# EAGLE board proto2 (EAGLE 6.6.0), part 1 of 2
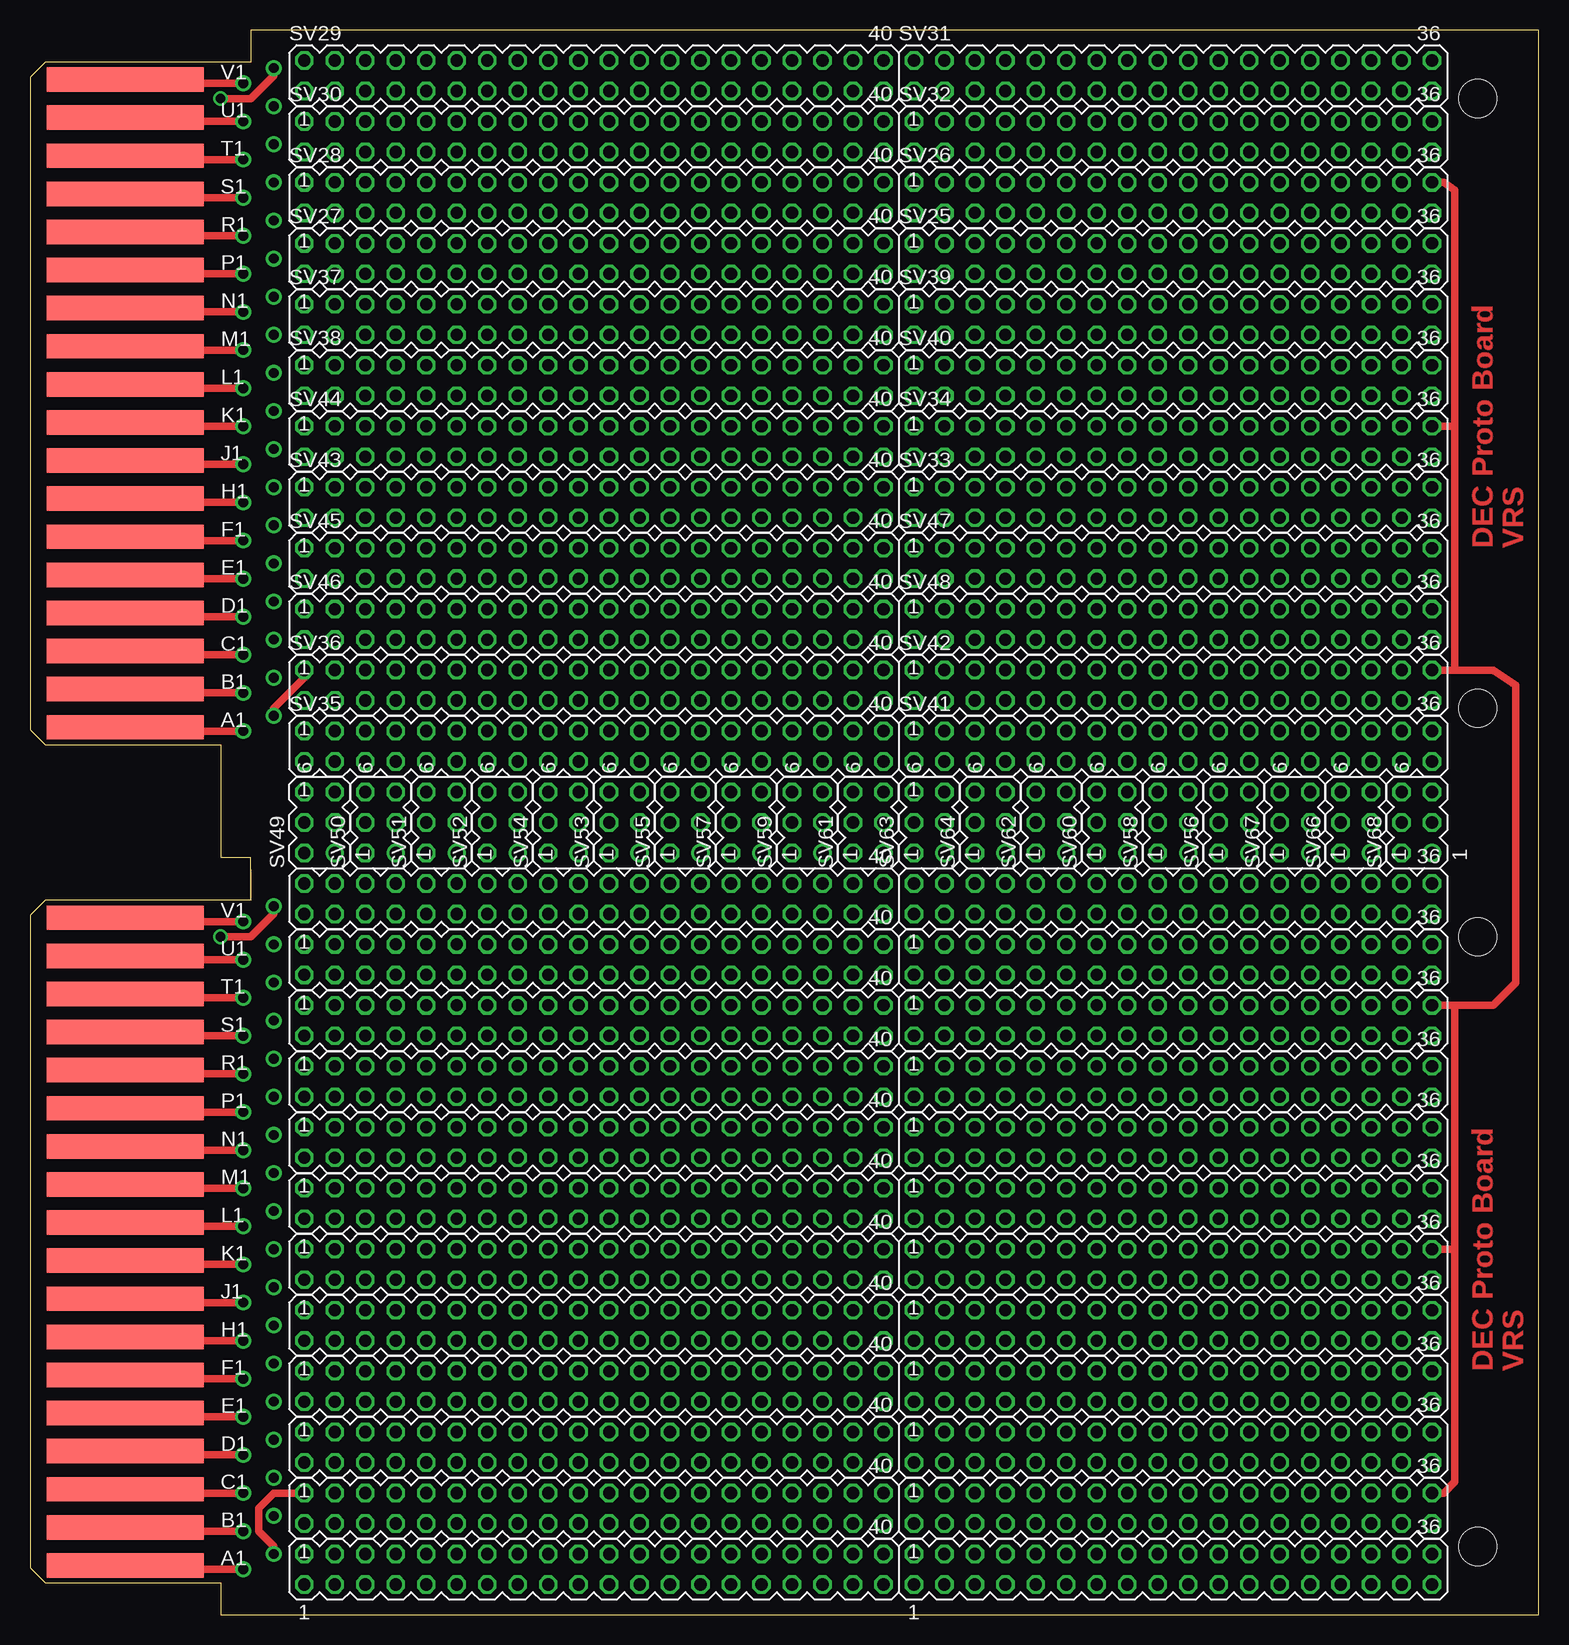
[diagram p1: board, top side]
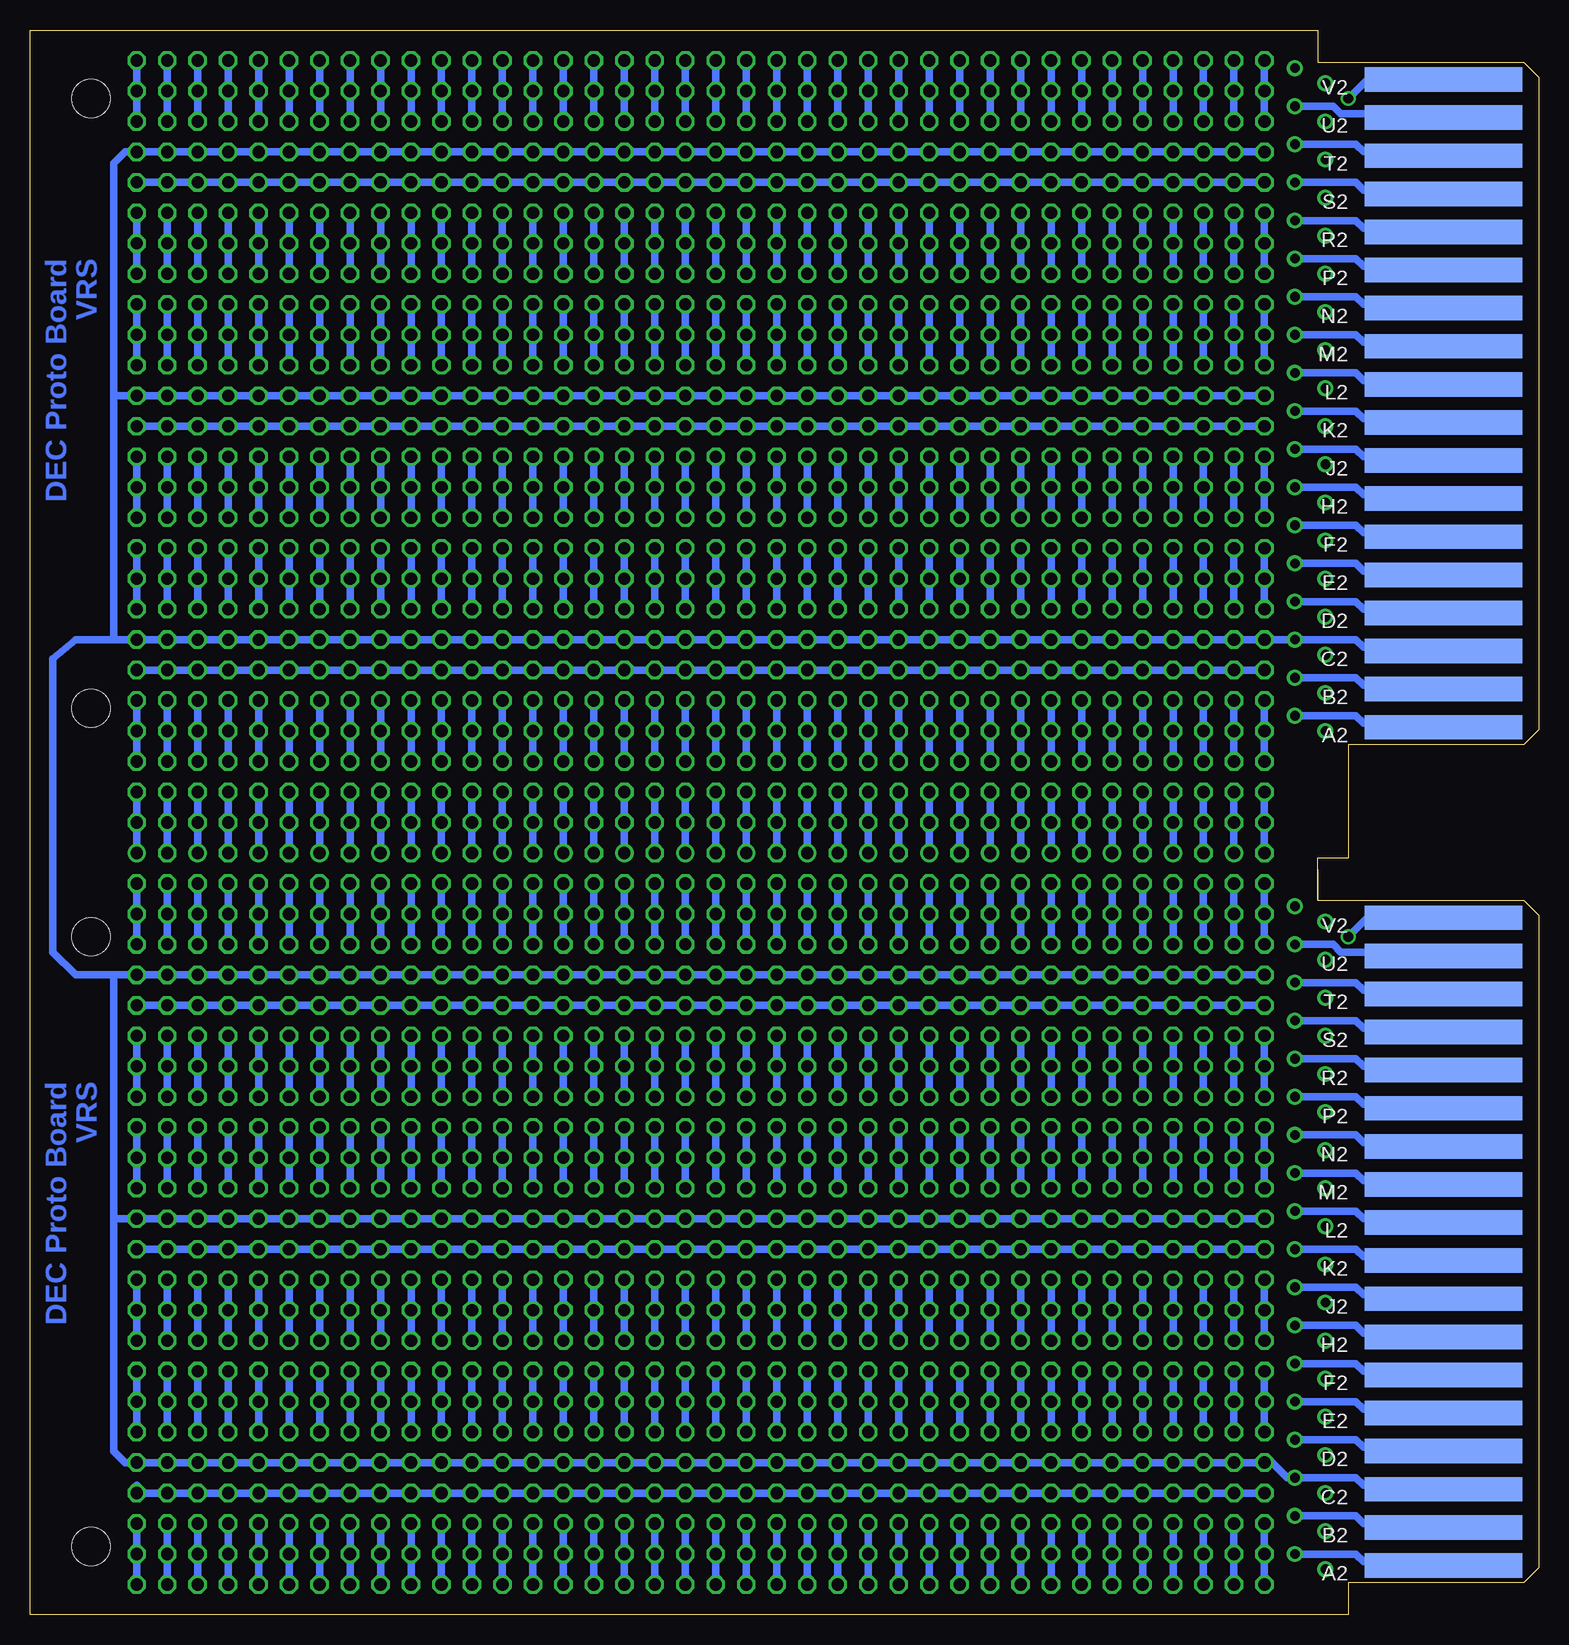
[diagram p2: board, bottom side, seen from below]

Size 125.73 x 132.08 mm. Coordinates in mm from the lower left corner, seen from the top.
Copper layers (1+16): Top 0.035mm / dielectric 1.5mm / Bottom 0.035mm
Design rules "16mils": minimum track width 16mil, minimum drill 32mil, track to track 15mil, track to pad 10mil, pad to pad 10mil, via to via 10mil, smd to smd 10mil, copper to edge 13mil, drill to drill 10mil, minimum pad ring 10mil, minimum via ring 8mil, stop-mask expansion 0mil, vias tented up to drill 0mil, thermal gap 10mil
Net classes: 0 default: width 0.635 mm

## Footprints (pad centres in the part's own frame; a part is rotated, then mirrored left to right if it is on the bottom)
EDGE-CON2 = smd 13.106 x 2.032: A1 7.938,4.128; B1 7.938,7.303; C1 7.938,10.477; D1 7.938,13.652; E1 7.938,16.828; F1 7.938,20.003; H1 7.938,23.177; J1 7.938,26.352; K1 7.938,29.527; L1 7.938,32.703; M1 7.938,35.877; N1 7.938,39.053; P1 7.938,42.227; R1 7.938,45.403; S1 7.938,48.578; T1 7.938,51.752; U1 7.938,54.928; V1 7.938,58.102 | smd 13.106 x 2.032 bottom: A2 7.938,4.128; B2 7.938,7.303; C2 7.938,10.477; D2 7.938,13.652; E2 7.938,16.828; F2 7.938,20.003; H2 7.938,23.177; J2 7.938,26.352; K2 7.938,29.527; L2 7.938,32.703; M2 7.938,35.877; N2 7.938,39.053; P2 7.938,42.227; R2 7.938,45.403; S2 7.938,48.578; T2 7.938,51.752; U2 7.938,54.928; V2 7.938,58.102
MA20-2 = drill 1.016 octagon: 1 -24.13,-1.27; 2 -24.13,1.27; 3 -21.59,-1.27; 4 -21.59,1.27; 5 -19.05,-1.27; 6 -19.05,1.27; 7 -16.51,-1.27; 8 -16.51,1.27; 9 -13.97,-1.27; 10 -13.97,1.27; 11 -11.43,-1.27; 12 -11.43,1.27; 13 -8.89,-1.27; 14 -8.89,1.27; 15 -6.35,-1.27; 16 -6.35,1.27; 17 -3.81,-1.27; 18 -3.81,1.27; 19 -1.27,-1.27; 20 -1.27,1.27; 21 1.27,-1.27; 22 1.27,1.27; 23 3.81,-1.27; 24 3.81,1.27; 25 6.35,-1.27; 26 6.35,1.27; 27 8.89,-1.27; 28 8.89,1.27; 29 11.43,-1.27; 30 11.43,1.27; 31 13.97,-1.27; 32 13.97,1.27; 33 16.51,-1.27; 34 16.51,1.27; 35 19.05,-1.27; 36 19.05,1.27; 37 21.59,-1.27; 38 21.59,1.27; 39 24.13,-1.27; 40 24.13,1.27
MA18-2 = drill 1.016 octagon: 1 -21.59,-1.27; 2 -21.59,1.27; 3 -19.05,-1.27; 4 -19.05,1.27; 5 -16.51,-1.27; 6 -16.51,1.27; 7 -13.97,-1.27; 8 -13.97,1.27; 9 -11.43,-1.27; 10 -11.43,1.27; 11 -8.89,-1.27; 12 -8.89,1.27; 13 -6.35,-1.27; 14 -6.35,1.27; 15 -3.81,-1.27; 16 -3.81,1.27; 17 -1.27,-1.27; 18 -1.27,1.27; 19 1.27,-1.27; 20 1.27,1.27; 21 3.81,-1.27; 22 3.81,1.27; 23 6.35,-1.27; 24 6.35,1.27; 25 8.89,-1.27; 26 8.89,1.27; 27 11.43,-1.27; 28 11.43,1.27; 29 13.97,-1.27; 30 13.97,1.27; 31 16.51,-1.27; 32 16.51,1.27; 33 19.05,-1.27; 34 19.05,1.27; 35 21.59,-1.27; 36 21.59,1.27
MA03-2 = drill 1.016: 1 -2.54,-1.27 | drill 1.016 octagon: 2 -2.54,1.27; 3 0,-1.27; 4 0,1.27; 5 2.54,-1.27; 6 2.54,1.27
THRU-HOLEA = drill 0.813 pad 1.27: A1 17.78,3.81; A2 20.32,5.08; B1 17.78,6.985; B2 20.32,8.255; C1 17.78,10.16; C2 20.32,11.43; D1 17.78,13.335; D2 20.32,14.605; E1 17.78,16.51; E2 20.32,17.78; F1 17.78,19.685; F2 20.32,20.955; H1 17.78,22.86; H2 20.32,24.13; J1 17.78,26.035; J2 20.32,27.305; K1 17.78,29.21; K2 20.32,30.48; L1 17.78,32.385; L2 20.32,33.655; M1 17.78,35.56; M2 20.32,36.83; N1 17.78,38.735; N2 20.32,40.005; P1 17.78,41.91; P2 20.32,43.18; R1 17.78,45.085; R2 20.32,46.355; S1 17.78,48.26; S2 20.32,49.53; T1 17.78,51.435; T2 20.32,52.705; U1 17.78,54.61; U2 20.32,55.88; V1 17.78,57.785; V2 20.32,59.055
DOUBLE = hole 3.175: 120.65,56.515; 120.65,5.715; 120.65,75.565; 120.65,126.365

## Placement (x,y rotation side)
A  [EDGE-CON2]  0,0 0 top
B  [EDGE-CON2]  0,69.85 0 top
SV1  [MA20-2]  46.99,3.81 0 top
SV2  [MA20-2]  46.99,8.89 0 top
SV3  [MA20-2]  46.99,19.05 0 top
SV4  [MA20-2]  46.99,13.97 0 top
SV5  [MA18-2]  95.25,19.05 0 top
SV6  [MA18-2]  95.25,13.97 0 top
SV7  [MA18-2]  95.25,3.81 0 top
SV8  [MA18-2]  95.25,8.89 0 top
SV9  [MA18-2]  95.25,24.13 0 top
SV10  [MA18-2]  95.25,29.21 0 top
SV11  [MA20-2]  46.99,24.13 0 top
SV12  [MA20-2]  46.99,29.21 0 top
SV13  [MA20-2]  46.99,39.37 0 top
SV14  [MA20-2]  46.99,34.29 0 top
SV15  [MA18-2]  95.25,39.37 0 top
SV16  [MA18-2]  95.25,34.29 0 top
SV17  [MA18-2]  95.25,44.45 0 top
SV18  [MA18-2]  95.25,49.53 0 top
SV19  [MA20-2]  46.99,44.45 0 top
SV20  [MA20-2]  46.99,49.53 0 top
SV21  [MA20-2]  46.99,59.69 0 top
SV22  [MA20-2]  46.99,54.61 0 top
SV23  [MA18-2]  95.25,59.69 0 top
SV24  [MA18-2]  95.25,54.61 0 top
SV25  [MA18-2]  95.25,113.03 0 top
SV26  [MA18-2]  95.25,118.11 0 top
SV27  [MA20-2]  46.99,113.03 0 top
SV28  [MA20-2]  46.99,118.11 0 top
SV29  [MA20-2]  46.99,128.27 0 top
SV30  [MA20-2]  46.99,123.19 0 top
SV31  [MA18-2]  95.25,128.27 0 top
SV32  [MA18-2]  95.25,123.19 0 top
SV33  [MA18-2]  95.25,92.71 0 top
SV34  [MA18-2]  95.25,97.79 0 top
SV35  [MA20-2]  46.99,72.39 0 top
SV36  [MA20-2]  46.99,77.47 0 top
SV37  [MA20-2]  46.99,107.95 0 top
SV38  [MA20-2]  46.99,102.87 0 top
SV39  [MA18-2]  95.25,107.95 0 top
SV40  [MA18-2]  95.25,102.87 0 top
SV41  [MA18-2]  95.25,72.39 0 top
SV42  [MA18-2]  95.25,77.47 0 top
SV43  [MA20-2]  46.99,92.71 0 top
SV44  [MA20-2]  46.99,97.79 0 top
SV45  [MA20-2]  46.99,87.63 0 top
SV46  [MA20-2]  46.99,82.55 0 top
SV47  [MA18-2]  95.25,87.63 0 top
SV48  [MA18-2]  95.25,82.55 0 top
SV49  [MA03-2]  24.13,66.04 90 top
SV50  [MA03-2]  29.21,66.04 90 top
SV51  [MA03-2]  34.29,66.04 90 top
SV52  [MA03-2]  39.37,66.04 90 top
SV53  [MA03-2]  49.53,66.04 90 top
SV54  [MA03-2]  44.45,66.04 90 top
SV55  [MA03-2]  54.61,66.04 90 top
SV56  [MA03-2]  100.33,66.04 90 top
SV57  [MA03-2]  59.69,66.04 90 top
SV58  [MA03-2]  95.25,66.04 90 top
SV59  [MA03-2]  64.77,66.04 90 top
SV60  [MA03-2]  90.17,66.04 90 top
SV61  [MA03-2]  69.85,66.04 90 top
SV62  [MA03-2]  85.09,66.04 90 top
SV63  [MA03-2]  74.93,66.04 90 top
SV64  [MA03-2]  80.01,66.04 90 top
SV66  [MA03-2]  110.49,66.04 90 top
SV67  [MA03-2]  105.41,66.04 90 top
SV68  [MA03-2]  115.57,66.04 90 top
U$3  THRU-HOLE2A  [THRU-HOLEA]  0,0 0 top
U$4  OUTLINE-DOUBLE  [DOUBLE]  0,0 0 top
U$5  THRU-HOLE2A  [THRU-HOLEA]  0,69.85 0 top

## Tracks (layer width: path | path; a pad name or v marks a point on that pad's centre or on a via)
GND
  Bottom 0.635: SV14.1 SV14.3 SV14.5 SV14.7 SV14.9 SV14.11 SV14.13 SV14.15 SV14.17 SV14.19 SV14.21 SV14.23 SV14.25 SV14.27 SV14.29 SV14.31 SV14.33 SV14.35 SV14.37 SV14.39 SV16.1 SV16.3 SV16.5 SV16.7 SV16.9 SV16.11 SV16.13 SV16.15 SV16.17 SV16.19 SV16.21 SV16.23 SV16.25 SV16.27 SV16.29 SV16.31 SV16.33 SV16.35 118.75,33.02 | A.C2 14.61,10.79 15.24,11.43 U$3.C2 20.96,11.43 22.23,12.7 SV4.1 SV4.3 SV4.5 SV4.7 SV4.9 SV4.11 SV4.13 SV4.15 SV4.17 SV4.19 SV4.21 SV4.23 SV4.25 SV4.27 SV4.29 SV4.31 SV4.33 SV4.35 SV4.37 SV4.39 SV6.1 SV6.3 SV6.5 SV6.7 SV6.9 SV6.11 SV6.13 SV6.15 SV6.17 SV6.19 SV6.21 SV6.23 SV6.25 SV6.27 SV6.29 SV6.31 SV6.33 SV6.35 117.79,12.7 118.75,13.65 118.75,33.02 | SV30.1 SV30.3 SV30.5 SV30.7 SV30.9 SV30.11 SV30.13 SV30.15 SV30.17 SV30.19 SV30.21 SV30.23 SV30.25 SV30.27 SV30.29 SV30.31 SV30.33 SV30.35 SV30.37 SV30.39 SV32.1 SV32.3 SV32.5 SV32.7 SV32.9 SV32.11 SV32.13 SV32.15 SV32.17 SV32.19 SV32.21 SV32.23 SV32.25 SV32.27 SV32.29 SV32.31 SV32.33 SV32.35 117.79,121.92 118.75,120.97 118.75,101.6 | SV38.1 SV38.3 SV38.5 SV38.7 SV38.9 SV38.11 SV38.13 SV38.15 SV38.17 SV38.19 SV38.21 SV38.23 SV38.25 SV38.27 SV38.29 SV38.31 SV38.33 SV38.35 SV38.37 SV38.39 SV40.1 SV40.3 SV40.5 SV40.7 SV40.9 SV40.11 SV40.13 SV40.15 SV40.17 SV40.19 SV40.21 SV40.23 SV40.25 SV40.27 SV40.29 SV40.31 SV40.33 SV40.35 118.75,101.6 | SV22.1 SV22.3 SV22.5 SV22.7 SV22.9 SV22.11 SV22.13 SV22.15 SV22.17 SV22.19 SV22.21 SV22.23 SV22.25 SV22.27 SV22.29 SV22.31 SV22.33 SV22.35 SV22.37 SV22.39 SV24.1 SV24.3 SV24.5 SV24.7 SV24.9 SV24.11 SV24.13 SV24.15 SV24.17 SV24.19 SV24.21 SV24.23 SV24.25 SV24.27 SV24.29 SV24.31 SV24.33 SV24.35 118.75,53.34
  Bottom 0.635: B.C2 14.61,80.64 15.24,81.28 U$5.C2 SV46.1 SV46.3 SV46.5 SV46.7 SV46.9 SV46.11 SV46.13 SV46.15 SV46.17 SV46.19 SV46.21 SV46.23 SV46.25 SV46.27 SV46.29 SV46.31 SV46.33 SV46.35 SV46.37 SV46.39 SV48.1 SV48.3 SV48.5 SV48.7 SV48.9 SV48.11 SV48.13 SV48.15 SV48.17 SV48.19 SV48.21 SV48.23 SV48.25 SV48.27 SV48.29 SV48.31 SV48.33 SV48.35 118.75,81.28 | 118.75,81.28 121.92,81.28 123.83,79.69 123.83,55.24 121.92,53.34 118.75,53.34 | 118.75,81.28 118.75,101.6 | 118.75,33.02 118.75,53.34
N$1
  Bottom 0.635: U$3.K2 15.24,30.48 14.61,29.84 A.K2
N$2
  Bottom 0.635: U$3.J2 15.24,27.3 14.61,26.67 A.J2
N$3
  Bottom 0.635: U$3.H2 15.24,24.13 14.61,23.5 A.H2
N$4
  Bottom 0.635: U$3.L2 15.24,33.66 14.61,33.02 A.L2
N$5
  Bottom 0.635: U$3.M2 15.24,36.83 14.61,36.2 A.M2
N$6
  Bottom 0.635: U$3.N2 15.24,40.01 14.61,39.37 A.N2
N$7
  Bottom 0.635: U$3.P2 15.24,43.18 14.61,42.55 A.P2
N$8
  Bottom 0.635: U$3.F2 15.24,20.95 14.61,20.32 A.F2
N$9
  Bottom 0.635: U$3.E2 15.24,17.78 14.61,17.14 A.E2
N$10
  Bottom 0.635: U$3.D2 15.24,14.61 14.61,13.97 A.D2
N$11
  Bottom 0.635: SV1.1 22.86,3.17 22.86,4.45 SV1.2 22.86,5.71 22.86,6.99 SV2.1
N$12
  Bottom 0.635: U$3.R2 15.24,46.35 14.61,45.72 A.R2
N$13
  Bottom 0.635: U$3.S2 15.24,49.53 14.61,48.9 A.S2
N$14
  Bottom 0.635: U$3.B2 15.24,8.26 14.61,7.62 A.B2
N$15
  Bottom 0.635: SV1.3 25.4,3.17 25.4,4.45 SV1.4 25.4,5.71 25.4,6.99 SV2.3
N$16
  Bottom 0.635: U$3.T2 15.24,52.7 14.61,52.07 A.T2
N$17
  Bottom 0.635: U$3.U2 19.69,55.88 17.15,55.88 16.51,55.24 13.97,55.24 A.U2
N$18  (via drill 0.81)
  Top 0.635: v15.88,56.52 18.42,56.52 20.32,58.42 U$3.V2
  Bottom 0.635: v15.88,56.52 13.97,58.42 A.V2
N$19
  Top 0.635: U$3.A1 17.15,3.81 13.97,3.81 A.A1
N$20
  Top 0.635: U$3.V1 17.15,57.78 13.97,57.78 A.V1
N$21
  Top 0.635: U$3.U1 17.15,54.61 13.97,54.61 A.U1
N$22
  Top 0.635: U$3.T1 17.15,51.44 13.97,51.44 A.T1
N$23
  Top 0.635: U$3.S1 17.15,48.26 13.97,48.26 A.S1
N$24
  Top 0.635: U$3.R1 17.15,45.09 13.97,45.09 A.R1
N$25
  Top 0.635: U$3.P1 17.15,41.91 13.97,41.91 A.P1
N$26
  Top 0.635: U$3.N1 17.15,38.73 13.97,38.73 A.N1
N$27
  Top 0.635: U$3.M1 17.15,35.56 13.97,35.56 A.M1
N$28
  Top 0.635: U$3.L1 17.15,32.38 13.97,32.38 A.L1
N$29
  Top 0.635: U$3.K1 17.15,29.21 13.97,29.21 A.K1
N$30
  Top 0.635: U$3.J1 17.15,26.04 13.97,26.04 A.J1
N$31
  Top 0.635: U$3.H1 17.15,22.86 13.97,22.86 A.H1
N$32
  Top 0.635: U$3.F1 17.15,19.68 13.97,19.68 A.F1
N$33
  Top 0.635: U$3.E1 17.15,16.51 13.97,16.51 A.E1
N$34
  Top 0.635: U$3.D1 17.15,13.34 13.97,13.34 A.D1
N$35
  Top 0.635: U$3.C1 17.15,10.16 13.97,10.16 A.C1
N$36
  Top 0.635: U$3.B1 17.15,6.99 13.97,6.99 A.B1
N$37
  Bottom 0.635: SV1.5 27.94,3.17 27.94,4.45 SV1.6 27.94,5.71 27.94,6.99 SV2.5
N$38
  Bottom 0.635: SV7.1 73.66,3.17 73.66,4.45 SV7.2 73.66,5.71 73.66,6.99 SV8.1
N$39
  Bottom 0.635: SV7.3 76.2,3.17 76.2,4.45 SV7.4 76.2,5.71 76.2,6.99 SV8.3
N$40
  Bottom 0.635: SV7.5 78.74,3.17 78.74,4.45 SV7.6 78.74,5.71 78.74,6.99 SV8.5
N$41
  Bottom 0.635: SV7.7 81.28,3.17 81.28,4.45 SV7.8 81.28,5.71 81.28,6.99 SV8.7
N$42
  Bottom 0.635: SV7.9 83.82,3.17 83.82,4.45 SV7.10 83.82,5.71 83.82,6.99 SV8.9
N$43
  Bottom 0.635: SV7.11 86.36,3.17 86.36,4.45 SV7.12 86.36,5.71 86.36,6.99 SV8.11
N$44
  Bottom 0.635: SV7.13 88.9,3.17 88.9,4.45 SV7.14 88.9,5.71 88.9,6.99 SV8.13
N$45
  Bottom 0.635: SV1.7 30.48,3.17 30.48,4.45 SV1.8 30.48,5.71 30.48,6.99 SV2.7
N$46
  Bottom 0.635: SV1.9 33.02,3.17 33.02,4.45 SV1.10 33.02,5.71 33.02,6.99 SV2.9
N$47
  Bottom 0.635: SV1.11 35.56,3.17 35.56,4.45 SV1.12 35.56,5.71 35.56,6.99 SV2.11
N$48
  Bottom 0.635: SV1.13 38.1,3.17 38.1,4.45 SV1.14 38.1,5.71 38.1,6.99 SV2.13
N$49
  Bottom 0.635: SV1.15 40.64,3.17 40.64,4.45 SV1.16 40.64,5.71 40.64,6.99 SV2.15
N$50
  Bottom 0.635: SV1.17 43.18,3.17 43.18,4.45 SV1.18 43.18,5.71 43.18,6.99 SV2.17
N$51
  Bottom 0.635: SV1.19 45.72,3.17 45.72,4.45 SV1.20 45.72,5.71 45.72,6.99 SV2.19
N$52
  Bottom 0.635: SV1.21 48.26,3.17 48.26,4.45 SV1.22 48.26,5.71 48.26,6.99 SV2.21
N$53
  Bottom 0.635: SV1.23 50.8,3.17 50.8,4.45 SV1.24 50.8,5.71 50.8,6.99 SV2.23
N$54
  Bottom 0.635: SV1.25 53.34,3.17 53.34,4.45 SV1.26 53.34,5.71 53.34,6.99 SV2.25
N$55
  Bottom 0.635: SV1.27 55.88,3.17 55.88,4.45 SV1.28 55.88,5.71 55.88,6.99 SV2.27
N$56
  Bottom 0.635: SV1.29 58.42,3.17 58.42,4.45 SV1.30 58.42,5.71 58.42,6.99 SV2.29
N$57
  Bottom 0.635: SV1.31 60.96,3.17 60.96,4.45 SV1.32 60.96,5.71 60.96,6.99 SV2.31
N$58
  Bottom 0.635: SV1.33 63.5,3.17 63.5,4.45 SV1.34 63.5,5.71 63.5,6.99 SV2.33
N$59
  Bottom 0.635: SV1.35 66.04,3.17 66.04,4.45 SV1.36 66.04,5.71 66.04,6.99 SV2.35
N$60
  Bottom 0.635: SV1.37 68.58,3.17 68.58,4.45 SV1.38 68.58,5.71 68.58,6.99 SV2.37
N$61
  Bottom 0.635: SV1.39 71.12,3.17 71.12,4.45 SV1.40 71.12,5.71 71.12,6.99 SV2.39
N$62
  Bottom 0.635: SV7.15 91.44,3.17 91.44,4.45 SV7.16 91.44,5.71 91.44,6.99 SV8.15
N$63
  Bottom 0.635: SV7.17 93.98,3.17 93.98,4.45 SV7.18 93.98,5.71 93.98,6.99 SV8.17
N$64
  Bottom 0.635: SV7.19 96.52,3.17 96.52,4.45 SV7.20 96.52,5.71 96.52,6.99 SV8.19
N$65
  Bottom 0.635: SV7.21 99.06,3.17 99.06,4.45 SV7.22 99.06,5.71 99.06,6.99 SV8.21
N$66
  Bottom 0.635: SV7.23 101.6,3.17 101.6,4.45 SV7.24 101.6,5.71 101.6,6.99 SV8.23
N$67
  Bottom 0.635: SV7.25 104.14,3.17 104.14,4.45 SV7.26 104.14,5.71 104.14,6.99 SV8.25
N$68
  Bottom 0.635: SV7.27 106.68,3.17 106.68,4.45 SV7.28 106.68,5.71 106.68,6.99 SV8.27
N$69
  Bottom 0.635: SV7.29 109.22,3.17 109.22,4.45 SV7.30 109.22,5.71 109.22,6.99 SV8.29
N$70
  Bottom 0.635: SV7.31 111.76,3.17 111.76,4.45 SV7.32 111.76,5.71 111.76,6.99 SV8.31
N$71
  Bottom 0.635: SV7.33 114.3,3.17 114.3,4.45 SV7.34 114.3,5.71 114.3,6.99 SV8.33
N$72
  Bottom 0.635: SV7.35 116.84,3.17 116.84,4.45 SV7.36 116.84,5.71 116.84,6.99 SV8.35
N$73
  Bottom 0.635: SV4.40 71.12,15.88 71.12,17.14 SV3.39 71.12,18.41 71.12,19.68 SV3.40
N$74
  Bottom 0.635: SV4.38 68.58,15.88 68.58,17.14 SV3.37 68.58,18.41 68.58,19.68 SV3.38
N$75
  Bottom 0.635: SV4.36 66.04,15.88 66.04,17.14 SV3.35 66.04,18.41 66.04,19.68 SV3.36
N$76
  Bottom 0.635: SV4.34 63.5,15.88 63.5,17.14 SV3.33 63.5,18.41 63.5,19.68 SV3.34
N$77
  Bottom 0.635: SV4.32 60.96,15.88 60.96,17.14 SV3.31 60.96,18.41 60.96,19.68 SV3.32
N$78
  Bottom 0.635: SV4.30 58.42,15.88 58.42,17.14 SV3.29 58.42,18.41 58.42,19.68 SV3.30
N$79
  Bottom 0.635: SV4.28 55.88,15.88 55.88,17.14 SV3.27 55.88,18.41 55.88,19.68 SV3.28
N$80
  Bottom 0.635: SV4.26 53.34,15.88 53.34,17.14 SV3.25 53.34,18.41 53.34,19.68 SV3.26
N$81
  Bottom 0.635: SV4.24 50.8,15.88 50.8,17.14 SV3.23 50.8,18.41 50.8,19.68 SV3.24
N$82
  Bottom 0.635: SV4.22 48.26,15.88 48.26,17.14 SV3.21 48.26,18.41 48.26,19.68 SV3.22
N$83
  Bottom 0.635: SV4.20 45.72,15.88 45.72,17.14 SV3.19 45.72,18.41 45.72,19.68 SV3.20
N$84
  Bottom 0.635: SV4.18 43.18,15.88 43.18,17.14 SV3.17 43.18,18.41 43.18,19.68 SV3.18
N$85
  Bottom 0.635: SV4.16 40.64,15.88 40.64,17.14 SV3.15 40.64,18.41 40.64,19.68 SV3.16
N$86
  Bottom 0.635: SV4.14 38.1,15.88 38.1,17.14 SV3.13 38.1,18.41 38.1,19.68 SV3.14
N$87
  Bottom 0.635: SV4.12 35.56,15.88 35.56,17.14 SV3.11 35.56,18.41 35.56,19.68 SV3.12
N$88
  Bottom 0.635: SV4.10 33.02,15.88 33.02,17.14 SV3.9 33.02,18.41 33.02,19.68 SV3.10
N$89
  Bottom 0.635: SV4.8 30.48,15.88 30.48,17.14 SV3.7 30.48,18.41 30.48,19.68 SV3.8
N$90
  Bottom 0.635: SV4.6 27.94,15.88 27.94,17.14 SV3.5 27.94,18.41 27.94,19.68 SV3.6
N$91
  Bottom 0.635: SV4.4 25.4,15.88 25.4,17.14 SV3.3 25.4,18.41 25.4,19.68 SV3.4
N$92
  Bottom 0.635: SV4.2 22.86,15.88 22.86,17.14 SV3.1 22.86,18.41 22.86,19.68 SV3.2
N$93
  Bottom 0.635: SV11.1 22.86,23.5 22.86,24.77 SV11.2 22.86,26.04 22.86,27.3 SV12.1
N$94
  Bottom 0.635: SV6.36 116.84,15.88 116.84,17.14 SV5.35 116.84,18.41 116.84,19.68 SV5.36
N$95
  Bottom 0.635: SV6.34 114.3,15.88 114.3,17.14 SV5.33 114.3,18.41 114.3,19.68 SV5.34
N$96
  Bottom 0.635: SV6.32 111.76,15.88 111.76,17.14 SV5.31 111.76,18.41 111.76,19.68 SV5.32
N$97
  Bottom 0.635: SV6.30 109.22,15.88 109.22,17.14 SV5.29 109.22,18.41 109.22,19.68 SV5.30
N$98
  Bottom 0.635: SV6.28 106.68,15.88 106.68,17.14 SV5.27 106.68,18.41 106.68,19.68 SV5.28
N$99
  Bottom 0.635: SV6.26 104.14,15.88 104.14,17.14 SV5.25 104.14,18.41 104.14,19.68 SV5.26
N$100
  Bottom 0.635: SV6.24 101.6,15.88 101.6,17.14 SV5.23 101.6,18.41 101.6,19.68 SV5.24
N$101
  Bottom 0.635: SV6.22 99.06,15.88 99.06,17.14 SV5.21 99.06,18.41 99.06,19.68 SV5.22
N$102
  Bottom 0.635: SV6.20 96.52,15.88 96.52,17.14 SV5.19 96.52,18.41 96.52,19.68 SV5.20
N$103
  Bottom 0.635: SV6.18 93.98,15.88 93.98,17.14 SV5.17 93.98,18.41 93.98,19.68 SV5.18
N$104
  Bottom 0.635: SV6.16 91.44,15.88 91.44,17.14 SV5.15 91.44,18.41 91.44,19.68 SV5.16
N$105
  Bottom 0.635: SV6.14 88.9,15.88 88.9,17.14 SV5.13 88.9,18.41 88.9,19.68 SV5.14
N$106
  Bottom 0.635: SV6.12 86.36,15.88 86.36,17.14 SV5.11 86.36,18.41 86.36,19.68 SV5.12
N$107
  Bottom 0.635: SV6.10 83.82,15.88 83.82,17.14 SV5.9 83.82,18.41 83.82,19.68 SV5.10
N$108
  Bottom 0.635: SV6.8 81.28,15.88 81.28,17.14 SV5.7 81.28,18.41 81.28,19.68 SV5.8
N$109
  Bottom 0.635: SV6.6 78.74,15.88 78.74,17.14 SV5.5 78.74,18.41 78.74,19.68 SV5.6
N$110
  Bottom 0.635: SV6.4 76.2,15.88 76.2,17.14 SV5.3 76.2,18.41 76.2,19.68 SV5.4
N$111
  Bottom 0.635: SV6.2 73.66,15.88 73.66,17.14 SV5.1 73.66,18.41 73.66,19.68 SV5.2
N$112
  Bottom 0.635: SV11.3 25.4,23.5 25.4,24.77 SV11.4 25.4,26.04 25.4,27.3 SV12.3
N$113
  Bottom 0.635: SV11.5 27.94,23.5 27.94,24.77 SV11.6 27.94,26.04 27.94,27.3 SV12.5
N$114
  Bottom 0.635: SV11.7 30.48,23.5 30.48,24.77 SV11.8 30.48,26.04 30.48,27.3 SV12.7
N$115
  Bottom 0.635: SV11.9 33.02,23.5 33.02,24.77 SV11.10 33.02,26.04 33.02,27.3 SV12.9
N$116
  Bottom 0.635: SV11.11 35.56,23.5 35.56,24.77 SV11.12 35.56,26.04 35.56,27.3 SV12.11
N$117
  Bottom 0.635: SV11.13 38.1,23.5 38.1,24.77 SV11.14 38.1,26.04 38.1,27.3 SV12.13
N$118
  Bottom 0.635: SV11.15 40.64,23.5 40.64,24.77 SV11.16 40.64,26.04 40.64,27.3 SV12.15
N$119
  Bottom 0.635: SV11.17 43.18,23.5 43.18,24.77 SV11.18 43.18,26.04 43.18,27.3 SV12.17
N$120
  Bottom 0.635: SV11.19 45.72,23.5 45.72,24.77 SV11.20 45.72,26.04 45.72,27.3 SV12.19
N$121
  Bottom 0.635: SV11.21 48.26,23.5 48.26,24.77 SV11.22 48.26,26.04 48.26,27.3 SV12.21
N$122
  Bottom 0.635: SV11.23 50.8,23.5 50.8,24.77 SV11.24 50.8,26.04 50.8,27.3 SV12.23
N$123
  Bottom 0.635: SV11.25 53.34,23.5 53.34,24.77 SV11.26 53.34,26.04 53.34,27.3 SV12.25
N$124
  Bottom 0.635: SV11.27 55.88,23.5 55.88,24.77 SV11.28 55.88,26.04 55.88,27.3 SV12.27
N$125
  Bottom 0.635: SV11.29 58.42,23.5 58.42,24.77 SV11.30 58.42,26.04 58.42,27.3 SV12.29
N$126
  Bottom 0.635: SV11.31 60.96,23.5 60.96,24.77 SV11.32 60.96,26.04 60.96,27.3 SV12.31
N$127
  Bottom 0.635: SV11.33 63.5,23.5 63.5,24.77 SV11.34 63.5,26.04 63.5,27.3 SV12.33
N$128
  Bottom 0.635: SV11.35 66.04,23.5 66.04,24.77 SV11.36 66.04,26.04 66.04,27.3 SV12.35
N$129
  Bottom 0.635: SV11.37 68.58,23.5 68.58,24.77 SV11.38 68.58,26.04 68.58,27.3 SV12.37
N$130
  Bottom 0.635: SV11.39 71.12,23.5 71.12,24.77 SV11.40 71.12,26.04 71.12,27.3 SV12.39
N$131
  Bottom 0.635: SV9.1 73.66,23.5 73.66,24.77 SV9.2 73.66,26.04 73.66,27.3 SV10.1
N$132
  Bottom 0.635: SV9.3 76.2,23.5 76.2,24.77 SV9.4 76.2,26.04 76.2,27.3 SV10.3
N$133
  Bottom 0.635: SV9.5 78.74,23.5 78.74,24.77 SV9.6 78.74,26.04 78.74,27.3 SV10.5
N$134
  Bottom 0.635: SV9.7 81.28,23.5 81.28,24.77 SV9.8 81.28,26.04 81.28,27.3 SV10.7
N$135
  Bottom 0.635: SV9.9 83.82,23.5 83.82,24.77 SV9.10 83.82,26.04 83.82,27.3 SV10.9
N$136
  Bottom 0.635: SV9.11 86.36,23.5 86.36,24.77 SV9.12 86.36,26.04 86.36,27.3 SV10.11
N$137
  Bottom 0.635: SV9.13 88.9,23.5 88.9,24.77 SV9.14 88.9,26.04 88.9,27.3 SV10.13
N$138
  Bottom 0.635: SV9.15 91.44,23.5 91.44,24.77 SV9.16 91.44,26.04 91.44,27.3 SV10.15
N$139
  Bottom 0.635: SV9.17 93.98,23.5 93.98,24.77 SV9.18 93.98,26.04 93.98,27.3 SV10.17
N$140
  Bottom 0.635: SV9.19 96.52,23.5 96.52,24.77 SV9.20 96.52,26.04 96.52,27.3 SV10.19
N$141
  Bottom 0.635: SV9.21 99.06,23.5 99.06,24.77 SV9.22 99.06,26.04 99.06,27.3 SV10.21
N$142
  Bottom 0.635: SV9.23 101.6,23.5 101.6,24.77 SV9.24 101.6,26.04 101.6,27.3 SV10.23
N$143
  Bottom 0.635: SV9.25 104.14,23.5 104.14,24.77 SV9.26 104.14,26.04 104.14,27.3 SV10.25
N$144
  Bottom 0.635: SV9.27 106.68,23.5 106.68,24.77 SV9.28 106.68,26.04 106.68,27.3 SV10.27
N$145
  Bottom 0.635: SV9.29 109.22,23.5 109.22,24.77 SV9.30 109.22,26.04 109.22,27.3 SV10.29
N$146
  Bottom 0.635: SV9.31 111.76,23.5 111.76,24.77 SV9.32 111.76,26.04 111.76,27.3 SV10.31
N$147
  Bottom 0.635: SV9.33 114.3,23.5 114.3,24.77 SV9.34 114.3,26.04 114.3,27.3 SV10.33
N$148
  Bottom 0.635: SV9.35 116.84,23.5 116.84,24.77 SV9.36 116.84,26.04 116.84,27.3 SV10.35
N$149
  Bottom 0.635: SV14.40 71.12,36.2 71.12,37.47 SV13.39 71.12,38.73 71.12,40.01 SV13.40
N$150
  Bottom 0.635: SV14.38 68.58,36.2 68.58,37.47 SV13.37 68.58,38.73 68.58,40.01 SV13.38
N$151
  Bottom 0.635: SV14.36 66.04,36.2 66.04,37.47 SV13.35 66.04,38.73 66.04,40.01 SV13.36
N$152
  Bottom 0.635: SV14.34 63.5,36.2 63.5,37.47 SV13.33 63.5,38.73 63.5,40.01 SV13.34
N$153
  Bottom 0.635: SV14.32 60.96,36.2 60.96,37.47 SV13.31 60.96,38.73 60.96,40.01 SV13.32
N$154
  Bottom 0.635: SV14.30 58.42,36.2 58.42,37.47 SV13.29 58.42,38.73 58.42,40.01 SV13.30
N$155
  Bottom 0.635: SV14.28 55.88,36.2 55.88,37.47 SV13.27 55.88,38.73 55.88,40.01 SV13.28
N$156
  Bottom 0.635: SV14.26 53.34,36.2 53.34,37.47 SV13.25 53.34,38.73 53.34,40.01 SV13.26
N$157
  Bottom 0.635: SV14.24 50.8,36.2 50.8,37.47 SV13.23 50.8,38.73 50.8,40.01 SV13.24
N$158
  Bottom 0.635: SV14.22 48.26,36.2 48.26,37.47 SV13.21 48.26,38.73 48.26,40.01 SV13.22
N$159
  Bottom 0.635: SV14.20 45.72,36.2 45.72,37.47 SV13.19 45.72,38.73 45.72,40.01 SV13.20
N$160
  Bottom 0.635: SV14.18 43.18,36.2 43.18,37.47 SV13.17 43.18,38.73 43.18,40.01 SV13.18
N$161
  Bottom 0.635: SV14.16 40.64,36.2 40.64,37.47 SV13.15 40.64,38.73 40.64,40.01 SV13.16
N$162
  Bottom 0.635: SV14.14 38.1,36.2 38.1,37.47 SV13.13 38.1,38.73 38.1,40.01 SV13.14
N$163
  Bottom 0.635: SV14.12 35.56,36.2 35.56,37.47 SV13.11 35.56,38.73 35.56,40.01 SV13.12
N$164
  Bottom 0.635: SV14.10 33.02,36.2 33.02,37.47 SV13.9 33.02,38.73 33.02,40.01 SV13.10
N$165
  Bottom 0.635: SV14.8 30.48,36.2 30.48,37.47 SV13.7 30.48,38.73 30.48,40.01 SV13.8
N$166
  Bottom 0.635: SV14.6 27.94,36.2 27.94,37.47 SV13.5 27.94,38.73 27.94,40.01 SV13.6
N$167
  Bottom 0.635: SV14.4 25.4,36.2 25.4,37.47 SV13.3 25.4,38.73 25.4,40.01 SV13.4
N$168
  Bottom 0.635: SV14.2 22.86,36.2 22.86,37.47 SV13.1 22.86,38.73 22.86,40.01 SV13.2
N$169
  Bottom 0.635: SV16.36 116.84,36.2 116.84,37.47 SV15.35 116.84,38.73 116.84,40.01 SV15.36
N$170
  Bottom 0.635: SV16.34 114.3,36.2 114.3,37.47 SV15.33 114.3,38.73 114.3,40.01 SV15.34
N$171
  Bottom 0.635: SV16.32 111.76,36.2 111.76,37.47 SV15.31 111.76,38.73 111.76,40.01 SV15.32
N$172
  Bottom 0.635: SV16.30 109.22,36.2 109.22,37.47 SV15.29 109.22,38.73 109.22,40.01 SV15.30
N$173
  Bottom 0.635: SV16.28 106.68,36.2 106.68,37.47 SV15.27 106.68,38.73 106.68,40.01 SV15.28
N$174
  Bottom 0.635: SV16.26 104.14,36.2 104.14,37.47 SV15.25 104.14,38.73 104.14,40.01 SV15.26
N$175
  Bottom 0.635: SV16.24 101.6,36.2 101.6,37.47 SV15.23 101.6,38.73 101.6,40.01 SV15.24
N$176
  Bottom 0.635: SV16.22 99.06,36.2 99.06,37.47 SV15.21 99.06,38.73 99.06,40.01 SV15.22
N$177
  Bottom 0.635: SV16.20 96.52,36.2 96.52,37.47 SV15.19 96.52,38.73 96.52,40.01 SV15.20
N$178
  Bottom 0.635: SV16.18 93.98,36.2 93.98,37.47 SV15.17 93.98,38.73 93.98,40.01 SV15.18
N$179
  Bottom 0.635: SV16.16 91.44,36.2 91.44,37.47 SV15.15 91.44,38.73 91.44,40.01 SV15.16
N$180
  Bottom 0.635: SV16.14 88.9,36.2 88.9,37.47 SV15.13 88.9,38.73 88.9,40.01 SV15.14
N$181
  Bottom 0.635: SV16.12 86.36,36.2 86.36,37.47 SV15.11 86.36,38.73 86.36,40.01 SV15.12
N$182
  Bottom 0.635: SV16.10 83.82,36.2 83.82,37.47 SV15.9 83.82,38.73 83.82,40.01 SV15.10
N$183
  Bottom 0.635: SV16.8 81.28,36.2 81.28,37.47 SV15.7 81.28,38.73 81.28,40.01 SV15.8
N$184
  Bottom 0.635: SV16.6 78.74,36.2 78.74,37.47 SV15.5 78.74,38.73 78.74,40.01 SV15.6
N$185
  Bottom 0.635: SV16.4 76.2,36.2 76.2,37.47 SV15.3 76.2,38.73 76.2,40.01 SV15.4
N$186
  Bottom 0.635: SV16.2 73.66,36.2 73.66,37.47 SV15.1 73.66,38.73 73.66,40.01 SV15.2
N$187
  Bottom 0.635: SV19.1 22.86,43.81 22.86,45.09 SV19.2 22.86,46.35 22.86,47.62 SV20.1
N$188
  Bottom 0.635: SV19.3 25.4,43.81 25.4,45.09 SV19.4 25.4,46.35 25.4,47.62 SV20.3
N$189
  Bottom 0.635: SV19.5 27.94,43.81 27.94,45.09 SV19.6 27.94,46.35 27.94,47.62 SV20.5
N$190
  Bottom 0.635: SV19.7 30.48,43.81 30.48,45.09 SV19.8 30.48,46.35 30.48,47.62 SV20.7
N$191
  Bottom 0.635: SV19.9 33.02,43.81 33.02,45.09 SV19.10 33.02,46.35 33.02,47.62 SV20.9
N$192
  Bottom 0.635: SV19.11 35.56,43.81 35.56,45.09 SV19.12 35.56,46.35 35.56,47.62 SV20.11
N$193
  Bottom 0.635: SV19.13 38.1,43.81 38.1,45.09 SV19.14 38.1,46.35 38.1,47.62 SV20.13
N$194
  Bottom 0.635: SV19.15 40.64,43.81 40.64,45.09 SV19.16 40.64,46.35 40.64,47.62 SV20.15
N$195
  Bottom 0.635: SV19.17 43.18,43.81 43.18,45.09 SV19.18 43.18,46.35 43.18,47.62 SV20.17
N$196
  Bottom 0.635: SV19.19 45.72,43.81 45.72,45.09 SV19.20 45.72,46.35 45.72,47.62 SV20.19
N$197
  Bottom 0.635: SV19.21 48.26,43.81 48.26,45.09 SV19.22 48.26,46.35 48.26,47.62 SV20.21
N$198
  Bottom 0.635: SV19.23 50.8,43.81 50.8,45.09 SV19.24 50.8,46.35 50.8,47.62 SV20.23
N$199
  Bottom 0.635: SV19.25 53.34,43.81 53.34,45.09 SV19.26 53.34,46.35 53.34,47.62 SV20.25
N$200
  Bottom 0.635: SV19.27 55.88,43.81 55.88,45.09 SV19.28 55.88,46.35 55.88,47.62 SV20.27
N$201
  Bottom 0.635: SV19.29 58.42,43.81 58.42,45.09 SV19.30 58.42,46.35 58.42,47.62 SV20.29
N$202
  Bottom 0.635: SV19.31 60.96,43.81 60.96,45.09 SV19.32 60.96,46.35 60.96,47.62 SV20.31
N$203
  Bottom 0.635: SV19.33 63.5,43.81 63.5,45.09 SV19.34 63.5,46.35 63.5,47.62 SV20.33
N$204
  Bottom 0.635: SV19.35 66.04,43.81 66.04,45.09 SV19.36 66.04,46.35 66.04,47.62 SV20.35
N$205
  Bottom 0.635: SV19.37 68.58,43.81 68.58,45.09 SV19.38 68.58,46.35 68.58,47.62 SV20.37
N$206
  Bottom 0.635: SV19.39 71.12,43.81 71.12,45.09 SV19.40 71.12,46.35 71.12,47.62 SV20.39
N$207
  Bottom 0.635: SV17.1 73.66,43.81 73.66,45.09 SV17.2 73.66,46.35 73.66,47.62 SV18.1
N$208
  Bottom 0.635: SV17.3 76.2,43.81 76.2,45.09 SV17.4 76.2,46.35 76.2,47.62 SV18.3
N$209
  Bottom 0.635: SV17.5 78.74,43.81 78.74,45.09 SV17.6 78.74,46.35 78.74,47.62 SV18.5
N$210
  Bottom 0.635: SV17.7 81.28,43.81 81.28,45.09 SV17.8 81.28,46.35 81.28,47.62 SV18.7
N$211
  Bottom 0.635: SV17.9 83.82,43.81 83.82,45.09 SV17.10 83.82,46.35 83.82,47.62 SV18.9
N$212
  Bottom 0.635: SV17.11 86.36,43.81 86.36,45.09 SV17.12 86.36,46.35 86.36,47.62 SV18.11
N$213
  Bottom 0.635: SV17.13 88.9,43.81 88.9,45.09 SV17.14 88.9,46.35 88.9,47.62 SV18.13
N$214
  Bottom 0.635: SV17.15 91.44,43.81 91.44,45.09 SV17.16 91.44,46.35 91.44,47.62 SV18.15
N$215
  Bottom 0.635: SV17.17 93.98,43.81 93.98,45.09 SV17.18 93.98,46.35 93.98,47.62 SV18.17
N$216
  Bottom 0.635: SV17.19 96.52,43.81 96.52,45.09 SV17.20 96.52,46.35 96.52,47.62 SV18.19
N$217
  Bottom 0.635: SV17.21 99.06,43.81 99.06,45.09 SV17.22 99.06,46.35 99.06,47.62 SV18.21
N$218
  Bottom 0.635: SV17.23 101.6,43.81 101.6,45.09 SV17.24 101.6,46.35 101.6,47.62 SV18.23
N$219
  Bottom 0.635: SV17.25 104.14,43.81 104.14,45.09 SV17.26 104.14,46.35 104.14,47.62 SV18.25
N$220
  Bottom 0.635: SV17.27 106.68,43.81 106.68,45.09 SV17.28 106.68,46.35 106.68,47.62 SV18.27
N$221
  Bottom 0.635: SV17.29 109.22,43.81 109.22,45.09 SV17.30 109.22,46.35 109.22,47.62 SV18.29
N$222
  Bottom 0.635: SV17.31 111.76,43.81 111.76,45.09 SV17.32 111.76,46.35 111.76,47.62 SV18.31
N$223
  Bottom 0.635: SV17.33 114.3,43.81 114.3,45.09 SV17.34 114.3,46.35 114.3,47.62 SV18.33
N$224
  Bottom 0.635: SV17.35 116.84,43.81 116.84,45.09 SV17.36 116.84,46.35 116.84,47.62 SV18.35
N$225
  Bottom 0.635: SV22.40 71.12,56.52 71.12,57.78 SV21.39 71.12,59.05 71.12,60.33 SV21.40
N$226
  Bottom 0.635: SV22.38 68.58,56.52 68.58,57.78 SV21.37 68.58,59.05 68.58,60.33 SV21.38
N$227
  Bottom 0.635: SV22.36 66.04,56.52 66.04,57.78 SV21.35 66.04,59.05 66.04,60.33 SV21.36
N$228
  Bottom 0.635: SV22.34 63.5,56.52 63.5,57.78 SV21.33 63.5,59.05 63.5,60.33 SV21.34
N$229
  Bottom 0.635: SV22.32 60.96,56.52 60.96,57.78 SV21.31 60.96,59.05 60.96,60.33 SV21.32
N$230
  Bottom 0.635: SV22.30 58.42,56.52 58.42,57.78 SV21.29 58.42,59.05 58.42,60.33 SV21.30
N$231
  Bottom 0.635: SV22.28 55.88,56.52 55.88,57.78 SV21.27 55.88,59.05 55.88,60.33 SV21.28
N$232
  Bottom 0.635: SV22.26 53.34,56.52 53.34,57.78 SV21.25 53.34,59.05 53.34,60.33 SV21.26
N$233
  Bottom 0.635: SV22.24 50.8,56.52 50.8,57.78 SV21.23 50.8,59.05 50.8,60.33 SV21.24
N$234
  Bottom 0.635: SV22.22 48.26,56.52 48.26,57.78 SV21.21 48.26,59.05 48.26,60.33 SV21.22
N$235
  Bottom 0.635: SV22.20 45.72,56.52 45.72,57.78 SV21.19 45.72,59.05 45.72,60.33 SV21.20
N$236
  Bottom 0.635: SV22.18 43.18,56.52 43.18,57.78 SV21.17 43.18,59.05 43.18,60.33 SV21.18
N$237
  Bottom 0.635: SV22.16 40.64,56.52 40.64,57.78 SV21.15 40.64,59.05 40.64,60.33 SV21.16
N$238
  Bottom 0.635: SV22.14 38.1,56.52 38.1,57.78 SV21.13 38.1,59.05 38.1,60.33 SV21.14
N$239
  Bottom 0.635: SV22.12 35.56,56.52 35.56,57.78 SV21.11 35.56,59.05 35.56,60.33 SV21.12
N$240
  Bottom 0.635: SV22.10 33.02,56.52 33.02,57.78 SV21.9 33.02,59.05 33.02,60.33 SV21.10
N$241
  Bottom 0.635: SV22.8 30.48,56.52 30.48,57.78 SV21.7 30.48,59.05 30.48,60.33 SV21.8
N$242
  Bottom 0.635: SV22.6 27.94,56.52 27.94,57.78 SV21.5 27.94,59.05 27.94,60.33 SV21.6
N$243
  Bottom 0.635: SV22.4 25.4,56.52 25.4,57.78 SV21.3 25.4,59.05 25.4,60.33 SV21.4
N$244
  Bottom 0.635: SV22.2 22.86,56.52 22.86,57.78 SV21.1 22.86,59.05 22.86,60.33 SV21.2
N$245
  Bottom 0.635: SV24.36 116.84,56.52 116.84,57.78 SV23.35 116.84,59.05 116.84,60.33 SV23.36
N$246
  Bottom 0.635: SV24.34 114.3,56.52 114.3,57.78 SV23.33 114.3,59.05 114.3,60.33 SV23.34
N$247
  Bottom 0.635: SV24.32 111.76,56.52 111.76,57.78 SV23.31 111.76,59.05 111.76,60.33 SV23.32
N$248
  Bottom 0.635: SV24.30 109.22,56.52 109.22,57.78 SV23.29 109.22,59.05 109.22,60.33 SV23.30
N$249
  Bottom 0.635: SV24.28 106.68,56.52 106.68,57.78 SV23.27 106.68,59.05 106.68,60.33 SV23.28
N$250
  Bottom 0.635: SV24.26 104.14,56.52 104.14,57.78 SV23.25 104.14,59.05 104.14,60.33 SV23.26
N$251
  Bottom 0.635: SV24.24 101.6,56.52 101.6,57.78 SV23.23 101.6,59.05 101.6,60.33 SV23.24
N$252
  Bottom 0.635: SV24.22 99.06,56.52 99.06,57.78 SV23.21 99.06,59.05 99.06,60.33 SV23.22
N$253
  Bottom 0.635: SV24.20 96.52,56.52 96.52,57.78 SV23.19 96.52,59.05 96.52,60.33 SV23.20
N$254
  Bottom 0.635: SV24.18 93.98,56.52 93.98,57.78 SV23.17 93.98,59.05 93.98,60.33 SV23.18
N$255
  Bottom 0.635: SV24.16 91.44,56.52 91.44,57.78 SV23.15 91.44,59.05 91.44,60.33 SV23.16
N$256
  Bottom 0.635: SV24.14 88.9,56.52 88.9,57.78 SV23.13 88.9,59.05 88.9,60.33 SV23.14
N$257
  Bottom 0.635: SV24.12 86.36,56.52 86.36,57.78 SV23.11 86.36,59.05 86.36,60.33 SV23.12
N$258
  Bottom 0.635: SV24.10 83.82,56.52 83.82,57.78 SV23.9 83.82,59.05 83.82,60.33 SV23.10
N$259
  Bottom 0.635: SV24.8 81.28,56.52 81.28,57.78 SV23.7 81.28,59.05 81.28,60.33 SV23.8
N$260
  Bottom 0.635: SV24.6 78.74,56.52 78.74,57.78 SV23.5 78.74,59.05 78.74,60.33 SV23.6
N$261
  Bottom 0.635: SV24.4 76.2,56.52 76.2,57.78 SV23.3 76.2,59.05 76.2,60.33 SV23.4
N$262
  Bottom 0.635: SV24.2 73.66,56.52 73.66,57.78 SV23.1 73.66,59.05 73.66,60.33 SV23.2
N$263
  Bottom 0.635: U$5.K2 15.24,100.33 14.61,99.69 B.K2
N$264
  Bottom 0.635: U$5.J2 15.24,97.16 14.61,96.52 B.J2
N$265
  Bottom 0.635: U$5.H2 15.24,93.98 14.61,93.34 B.H2
N$266
  Bottom 0.635: U$5.L2 15.24,103.5 14.61,102.87 B.L2
N$267
  Bottom 0.635: U$5.M2 15.24,106.68 14.61,106.05 B.M2
N$268
  Bottom 0.635: U$5.N2 15.24,109.86 14.61,109.22 B.N2
N$269
  Bottom 0.635: U$5.P2 15.24,113.03 14.61,112.39 B.P2
N$270
  Bottom 0.635: U$5.F2 15.24,90.81 14.61,90.17 B.F2
N$271
  Bottom 0.635: U$5.E2 15.24,87.63 14.61,87 B.E2
N$272
  Bottom 0.635: U$5.D2 15.24,84.45 14.61,83.82 B.D2
N$273
  Bottom 0.635: U$5.R2 15.24,116.2 14.61,115.57 B.R2
N$274
  Bottom 0.635: U$5.S2 15.24,119.38 14.61,118.75 B.S2
N$275
  Bottom 0.635: U$5.B2 15.24,78.11 14.61,77.47 B.B2
N$276
  Bottom 0.635: U$5.T2 15.24,122.56 14.61,121.92 B.T2
N$277
  Bottom 0.635: U$5.U2 19.69,125.73 17.15,125.73 16.51,125.09 13.97,125.09 B.U2
N$278  (via drill 0.81)
  Top 0.635: v15.88,126.36 18.42,126.36 20.32,128.27 U$5.V2
  Bottom 0.635: v15.88,126.36 13.97,128.27 B.V2
N$279
  Top 0.635: U$5.A1 17.15,73.66 13.97,73.66 B.A1
N$280
  Top 0.635: U$5.V1 17.15,127.64 13.97,127.64 B.V1
N$281
  Top 0.635: U$5.U1 17.15,124.46 13.97,124.46 B.U1
N$282
  Top 0.635: U$5.T1 17.15,121.28 13.97,121.28 B.T1
N$283
  Top 0.635: U$5.S1 17.15,118.11 13.97,118.11 B.S1
N$284
  Top 0.635: U$5.R1 17.15,114.94 13.97,114.94 B.R1
N$285
  Top 0.635: U$5.P1 17.15,111.76 13.97,111.76 B.P1
N$286
  Top 0.635: U$5.N1 17.15,108.58 13.97,108.58 B.N1
N$287
  Top 0.635: U$5.M1 17.15,105.41 13.97,105.41 B.M1
N$288
  Top 0.635: U$5.L1 17.15,102.23 13.97,102.23 B.L1
N$289
  Top 0.635: U$5.K1 17.15,99.06 13.97,99.06 B.K1
N$290
  Top 0.635: U$5.J1 17.15,95.89 13.97,95.89 B.J1
N$291
  Top 0.635: U$5.H1 17.15,92.71 13.97,92.71 B.H1
N$292
  Top 0.635: U$5.F1 17.15,89.53 13.97,89.53 B.F1
N$293
  Top 0.635: U$5.E1 17.15,86.36 13.97,86.36 B.E1
N$294
  Top 0.635: U$5.D1 17.15,83.19 13.97,83.19 B.D1
N$295
  Top 0.635: U$5.C1 17.15,80.01 13.97,80.01 B.C1
N$296
  Top 0.635: U$5.B1 17.15,76.83 13.97,76.83 B.B1
N$297
  Bottom 0.635: SV27.1 22.86,112.39 22.86,113.67 SV27.2 22.86,114.94 22.86,116.2 SV28.1
N$298
  Bottom 0.635: SV27.3 25.4,112.39 25.4,113.67 SV27.4 25.4,114.94 25.4,116.2 SV28.3
N$299
  Bottom 0.635: SV27.5 27.94,112.39 27.94,113.67 SV27.6 27.94,114.94 27.94,116.2 SV28.5
N$300
  Bottom 0.635: SV27.7 30.48,112.39 30.48,113.67 SV27.8 30.48,114.94 30.48,116.2 SV28.7
N$301
  Bottom 0.635: SV27.9 33.02,112.39 33.02,113.67 SV27.10 33.02,114.94 33.02,116.2 SV28.9
N$302
  Bottom 0.635: SV27.11 35.56,112.39 35.56,113.67 SV27.12 35.56,114.94 35.56,116.2 SV28.11
N$303
  Bottom 0.635: SV27.13 38.1,112.39 38.1,113.67 SV27.14 38.1,114.94 38.1,116.2 SV28.13
N$304
  Bottom 0.635: SV27.15 40.64,112.39 40.64,113.67 SV27.16 40.64,114.94 40.64,116.2 SV28.15
N$305
  Bottom 0.635: SV27.17 43.18,112.39 43.18,113.67 SV27.18 43.18,114.94 43.18,116.2 SV28.17
N$306
  Bottom 0.635: SV27.19 45.72,112.39 45.72,113.67 SV27.20 45.72,114.94 45.72,116.2 SV28.19
N$307
  Bottom 0.635: SV27.21 48.26,112.39 48.26,113.67 SV27.22 48.26,114.94 48.26,116.2 SV28.21
N$308
  Bottom 0.635: SV27.23 50.8,112.39 50.8,113.67 SV27.24 50.8,114.94 50.8,116.2 SV28.23
N$309
  Bottom 0.635: SV27.25 53.34,112.39 53.34,113.67 SV27.26 53.34,114.94 53.34,116.2 SV28.25
N$310
  Bottom 0.635: SV27.27 55.88,112.39 55.88,113.67 SV27.28 55.88,114.94 55.88,116.2 SV28.27
N$311
  Bottom 0.635: SV27.29 58.42,112.39 58.42,113.67 SV27.30 58.42,114.94 58.42,116.2 SV28.29
N$312
  Bottom 0.635: SV27.31 60.96,112.39 60.96,113.67 SV27.32 60.96,114.94 60.96,116.2 SV28.31
N$313
  Bottom 0.635: SV27.33 63.5,112.39 63.5,113.67 SV27.34 63.5,114.94 63.5,116.2 SV28.33
N$314
  Bottom 0.635: SV27.35 66.04,112.39 66.04,113.67 SV27.36 66.04,114.94 66.04,116.2 SV28.35
N$315
  Bottom 0.635: SV27.37 68.58,112.39 68.58,113.67 SV27.38 68.58,114.94 68.58,116.2 SV28.37
N$316
  Bottom 0.635: SV27.39 71.12,112.39 71.12,113.67 SV27.40 71.12,114.94 71.12,116.2 SV28.39
N$317
  Bottom 0.635: SV25.1 73.66,112.39 73.66,113.67 SV25.2 73.66,114.94 73.66,116.2 SV26.1
N$318
  Bottom 0.635: SV25.3 76.2,112.39 76.2,113.67 SV25.4 76.2,114.94 76.2,116.2 SV26.3
N$319
  Bottom 0.635: SV25.5 78.74,112.39 78.74,113.67 SV25.6 78.74,114.94 78.74,116.2 SV26.5
N$320
  Bottom 0.635: SV25.7 81.28,112.39 81.28,113.67 SV25.8 81.28,114.94 81.28,116.2 SV26.7
N$321
  Bottom 0.635: SV25.9 83.82,112.39 83.82,113.67 SV25.10 83.82,114.94 83.82,116.2 SV26.9
N$322
  Bottom 0.635: SV25.11 86.36,112.39 86.36,113.67 SV25.12 86.36,114.94 86.36,116.2 SV26.11
N$323
  Bottom 0.635: SV25.13 88.9,112.39 88.9,113.67 SV25.14 88.9,114.94 88.9,116.2 SV26.13
N$324
  Bottom 0.635: SV25.15 91.44,112.39 91.44,113.67 SV25.16 91.44,114.94 91.44,116.2 SV26.15
N$325
  Bottom 0.635: SV25.17 93.98,112.39 93.98,113.67 SV25.18 93.98,114.94 93.98,116.2 SV26.17
N$326
  Bottom 0.635: SV25.19 96.52,112.39 96.52,113.67 SV25.20 96.52,114.94 96.52,116.2 SV26.19
N$327
  Bottom 0.635: SV25.21 99.06,112.39 99.06,113.67 SV25.22 99.06,114.94 99.06,116.2 SV26.21
N$328
  Bottom 0.635: SV25.23 101.6,112.39 101.6,113.67 SV25.24 101.6,114.94 101.6,116.2 SV26.23
N$329
  Bottom 0.635: SV25.25 104.14,112.39 104.14,113.67 SV25.26 104.14,114.94 104.14,116.2 SV26.25
N$330
  Bottom 0.635: SV25.27 106.68,112.39 106.68,113.67 SV25.28 106.68,114.94 106.68,116.2 SV26.27
N$331
  Bottom 0.635: SV25.29 109.22,112.39 109.22,113.67 SV25.30 109.22,114.94 109.22,116.2 SV26.29
N$332
  Bottom 0.635: SV25.31 111.76,112.39 111.76,113.67 SV25.32 111.76,114.94 111.76,116.2 SV26.31
N$333
  Bottom 0.635: SV25.33 114.3,112.39 114.3,113.67 SV25.34 114.3,114.94 114.3,116.2 SV26.33
N$334
  Bottom 0.635: SV25.35 116.84,112.39 116.84,113.67 SV25.36 116.84,114.94 116.84,116.2 SV26.35
N$335
  Bottom 0.635: SV30.40 71.12,125.09 71.12,126.36 SV29.39 71.12,127.64 71.12,128.91 SV29.40
N$336
  Bottom 0.635: SV30.38 68.58,125.09 68.58,126.36 SV29.37 68.58,127.64 68.58,128.91 SV29.38
N$337
  Bottom 0.635: SV30.36 66.04,125.09 66.04,126.36 SV29.35 66.04,127.64 66.04,128.91 SV29.36
N$338
  Bottom 0.635: SV30.34 63.5,125.09 63.5,126.36 SV29.33 63.5,127.64 63.5,128.91 SV29.34
N$339
  Bottom 0.635: SV30.32 60.96,125.09 60.96,126.36 SV29.31 60.96,127.64 60.96,128.91 SV29.32
N$340
  Bottom 0.635: SV30.30 58.42,125.09 58.42,126.36 SV29.29 58.42,127.64 58.42,128.91 SV29.30
N$341
  Bottom 0.635: SV30.28 55.88,125.09 55.88,126.36 SV29.27 55.88,127.64 55.88,128.91 SV29.28
N$342
  Bottom 0.635: SV30.26 53.34,125.09 53.34,126.36 SV29.25 53.34,127.64 53.34,128.91 SV29.26
N$343
  Bottom 0.635: SV30.24 50.8,125.09 50.8,126.36 SV29.23 50.8,127.64 50.8,128.91 SV29.24
N$344
  Bottom 0.635: SV30.22 48.26,125.09 48.26,126.36 SV29.21 48.26,127.64 48.26,128.91 SV29.22
N$345
  Bottom 0.635: SV30.20 45.72,125.09 45.72,126.36 SV29.19 45.72,127.64 45.72,128.91 SV29.20
N$346
  Bottom 0.635: SV30.18 43.18,125.09 43.18,126.36 SV29.17 43.18,127.64 43.18,128.91 SV29.18
N$347
  Bottom 0.635: SV30.16 40.64,125.09 40.64,126.36 SV29.15 40.64,127.64 40.64,128.91 SV29.16
N$348
  Bottom 0.635: SV30.14 38.1,125.09 38.1,126.36 SV29.13 38.1,127.64 38.1,128.91 SV29.14
N$349
  Bottom 0.635: SV30.12 35.56,125.09 35.56,126.36 SV29.11 35.56,127.64 35.56,128.91 SV29.12
N$350
  Bottom 0.635: SV30.10 33.02,125.09 33.02,126.36 SV29.9 33.02,127.64 33.02,128.91 SV29.10
N$351
  Bottom 0.635: SV30.8 30.48,125.09 30.48,126.36 SV29.7 30.48,127.64 30.48,128.91 SV29.8
N$352
  Bottom 0.635: SV30.6 27.94,125.09 27.94,126.36 SV29.5 27.94,127.64 27.94,128.91 SV29.6
N$353
  Bottom 0.635: SV30.4 25.4,125.09 25.4,126.36 SV29.3 25.4,127.64 25.4,128.91 SV29.4
N$354
  Bottom 0.635: SV30.2 22.86,125.09 22.86,126.36 SV29.1 22.86,127.64 22.86,128.91 SV29.2
N$355
  Bottom 0.635: SV32.36 116.84,125.09 116.84,126.36 SV31.35 116.84,127.64 116.84,128.91 SV31.36
N$356
  Bottom 0.635: SV32.34 114.3,125.09 114.3,126.36 SV31.33 114.3,127.64 114.3,128.91 SV31.34
N$357
  Bottom 0.635: SV32.32 111.76,125.09 111.76,126.36 SV31.31 111.76,127.64 111.76,128.91 SV31.32
N$358
  Bottom 0.635: SV32.30 109.22,125.09 109.22,126.36 SV31.29 109.22,127.64 109.22,128.91 SV31.30
N$359
  Bottom 0.635: SV32.28 106.68,125.09 106.68,126.36 SV31.27 106.68,127.64 106.68,128.91 SV31.28
N$360
  Bottom 0.635: SV32.26 104.14,125.09 104.14,126.36 SV31.25 104.14,127.64 104.14,128.91 SV31.26
N$361
  Bottom 0.635: SV32.24 101.6,125.09 101.6,126.36 SV31.23 101.6,127.64 101.6,128.91 SV31.24
N$362
  Bottom 0.635: SV32.22 99.06,125.09 99.06,126.36 SV31.21 99.06,127.64 99.06,128.91 SV31.22
N$363
  Bottom 0.635: SV32.20 96.52,125.09 96.52,126.36 SV31.19 96.52,127.64 96.52,128.91 SV31.20
N$364
  Bottom 0.635: SV32.18 93.98,125.09 93.98,126.36 SV31.17 93.98,127.64 93.98,128.91 SV31.18
N$365
  Bottom 0.635: SV32.16 91.44,125.09 91.44,126.36 SV31.15 91.44,127.64 91.44,128.91 SV31.16
N$366
  Bottom 0.635: SV32.14 88.9,125.09 88.9,126.36 SV31.13 88.9,127.64 88.9,128.91 SV31.14
N$367
  Bottom 0.635: SV32.12 86.36,125.09 86.36,126.36 SV31.11 86.36,127.64 86.36,128.91 SV31.12
N$368
  Bottom 0.635: SV32.10 83.82,125.09 83.82,126.36 SV31.9 83.82,127.64 83.82,128.91 SV31.10
N$369
  Bottom 0.635: SV32.8 81.28,125.09 81.28,126.36 SV31.7 81.28,127.64 81.28,128.91 SV31.8
N$370
  Bottom 0.635: SV32.6 78.74,125.09 78.74,126.36 SV31.5 78.74,127.64 78.74,128.91 SV31.6
N$371
  Bottom 0.635: SV32.4 76.2,125.09 76.2,126.36 SV31.3 76.2,127.64 76.2,128.91 SV31.4
N$372
  Bottom 0.635: SV32.2 73.66,125.09 73.66,126.36 SV31.1 73.66,127.64 73.66,128.91 SV31.2
N$373
  Bottom 0.635: SV35.1 22.86,71.75 22.86,73.03 SV35.2 22.86,74.3 22.86,75.56 SV36.1
N$374
  Bottom 0.635: SV35.3 25.4,71.75 25.4,73.03 SV35.4 25.4,74.3 25.4,75.56 SV36.3
N$375
  Bottom 0.635: SV35.5 27.94,71.75 27.94,73.03 SV35.6 27.94,74.3 27.94,75.56 SV36.5
N$376
  Bottom 0.635: SV35.7 30.48,71.75 30.48,73.03 SV35.8 30.48,74.3 30.48,75.56 SV36.7
N$377
  Bottom 0.635: SV35.9 33.02,71.75 33.02,73.03 SV35.10 33.02,74.3 33.02,75.56 SV36.9
N$378
  Bottom 0.635: SV35.11 35.56,71.75 35.56,73.03 SV35.12 35.56,74.3 35.56,75.56 SV36.11
N$379
  Bottom 0.635: SV35.13 38.1,71.75 38.1,73.03 SV35.14 38.1,74.3 38.1,75.56 SV36.13
N$380
  Bottom 0.635: SV35.15 40.64,71.75 40.64,73.03 SV35.16 40.64,74.3 40.64,75.56 SV36.15
N$381
  Bottom 0.635: SV35.17 43.18,71.75 43.18,73.03 SV35.18 43.18,74.3 43.18,75.56 SV36.17
N$382
  Bottom 0.635: SV35.19 45.72,71.75 45.72,73.03 SV35.20 45.72,74.3 45.72,75.56 SV36.19
N$383
  Bottom 0.635: SV35.21 48.26,71.75 48.26,73.03 SV35.22 48.26,74.3 48.26,75.56 SV36.21
N$384
  Bottom 0.635: SV35.23 50.8,71.75 50.8,73.03 SV35.24 50.8,74.3 50.8,75.56 SV36.23
N$385
  Bottom 0.635: SV35.25 53.34,71.75 53.34,73.03 SV35.26 53.34,74.3 53.34,75.56 SV36.25
N$386
  Bottom 0.635: SV35.27 55.88,71.75 55.88,73.03 SV35.28 55.88,74.3 55.88,75.56 SV36.27
N$387
  Bottom 0.635: SV35.29 58.42,71.75 58.42,73.03 SV35.30 58.42,74.3 58.42,75.56 SV36.29
N$388
  Bottom 0.635: SV35.31 60.96,71.75 60.96,73.03 SV35.32 60.96,74.3 60.96,75.56 SV36.31
N$389
  Bottom 0.635: SV35.33 63.5,71.75 63.5,73.03 SV35.34 63.5,74.3 63.5,75.56 SV36.33
N$390
  Bottom 0.635: SV35.35 66.04,71.75 66.04,73.03 SV35.36 66.04,74.3 66.04,75.56 SV36.35
N$391
  Bottom 0.635: SV35.37 68.58,71.75 68.58,73.03 SV35.38 68.58,74.3 68.58,75.56 SV36.37
N$392
  Bottom 0.635: SV35.39 71.12,71.75 71.12,73.03 SV35.40 71.12,74.3 71.12,75.56 SV36.39
N$393
  Bottom 0.635: SV33.1 73.66,92.08 73.66,93.34 SV33.2 73.66,94.61 73.66,95.89 SV34.1
N$394
  Bottom 0.635: SV33.3 76.2,92.08 76.2,93.34 SV33.4 76.2,94.61 76.2,95.89 SV34.3
N$395
  Bottom 0.635: SV33.5 78.74,92.08 78.74,93.34 SV33.6 78.74,94.61 78.74,95.89 SV34.5
N$396
  Bottom 0.635: SV33.7 81.28,92.08 81.28,93.34 SV33.8 81.28,94.61 81.28,95.89 SV34.7
N$397
  Bottom 0.635: SV33.9 83.82,92.08 83.82,93.34 SV33.10 83.82,94.61 83.82,95.89 SV34.9
N$398
  Bottom 0.635: SV33.11 86.36,92.08 86.36,93.34 SV33.12 86.36,94.61 86.36,95.89 SV34.11
N$399
  Bottom 0.635: SV33.13 88.9,92.08 88.9,93.34 SV33.14 88.9,94.61 88.9,95.89 SV34.13
N$400
  Bottom 0.635: SV33.15 91.44,92.08 91.44,93.34 SV33.16 91.44,94.61 91.44,95.89 SV34.15
N$401
  Bottom 0.635: SV33.17 93.98,92.08 93.98,93.34 SV33.18 93.98,94.61 93.98,95.89 SV34.17
N$402
  Bottom 0.635: SV33.19 96.52,92.08 96.52,93.34 SV33.20 96.52,94.61 96.52,95.89 SV34.19
N$403
  Bottom 0.635: SV33.21 99.06,92.08 99.06,93.34 SV33.22 99.06,94.61 99.06,95.89 SV34.21
N$404
  Bottom 0.635: SV33.23 101.6,92.08 101.6,93.34 SV33.24 101.6,94.61 101.6,95.89 SV34.23
N$405
  Bottom 0.635: SV33.25 104.14,92.08 104.14,93.34 SV33.26 104.14,94.61 104.14,95.89 SV34.25
N$406
  Bottom 0.635: SV33.27 106.68,92.08 106.68,93.34 SV33.28 106.68,94.61 106.68,95.89 SV34.27
N$407
  Bottom 0.635: SV33.29 109.22,92.08 109.22,93.34 SV33.30 109.22,94.61 109.22,95.89 SV34.29
N$408
  Bottom 0.635: SV33.31 111.76,92.08 111.76,93.34 SV33.32 111.76,94.61 111.76,95.89 SV34.31
N$409
  Bottom 0.635: SV33.33 114.3,92.08 114.3,93.34 SV33.34 114.3,94.61 114.3,95.89 SV34.33
N$410
  Bottom 0.635: SV33.35 116.84,92.08 116.84,93.34 SV33.36 116.84,94.61 116.84,95.89 SV34.35
N$411
  Bottom 0.635: SV38.40 71.12,104.78 71.12,106.05 SV37.39 71.12,107.31 71.12,108.58 SV37.40
N$412
  Bottom 0.635: SV38.38 68.58,104.78 68.58,106.05 SV37.37 68.58,107.31 68.58,108.58 SV37.38
N$413
  Bottom 0.635: SV38.36 66.04,104.78 66.04,106.05 SV37.35 66.04,107.31 66.04,108.58 SV37.36
N$414
  Bottom 0.635: SV38.34 63.5,104.78 63.5,106.05 SV37.33 63.5,107.31 63.5,108.58 SV37.34
N$415
  Bottom 0.635: SV38.32 60.96,104.78 60.96,106.05 SV37.31 60.96,107.31 60.96,108.58 SV37.32
N$416
  Bottom 0.635: SV38.30 58.42,104.78 58.42,106.05 SV37.29 58.42,107.31 58.42,108.58 SV37.30
N$417
  Bottom 0.635: SV38.28 55.88,104.78 55.88,106.05 SV37.27 55.88,107.31 55.88,108.58 SV37.28
N$418
  Bottom 0.635: SV38.26 53.34,104.78 53.34,106.05 SV37.25 53.34,107.31 53.34,108.58 SV37.26
N$419
  Bottom 0.635: SV38.24 50.8,104.78 50.8,106.05 SV37.23 50.8,107.31 50.8,108.58 SV37.24
N$420
  Bottom 0.635: SV38.22 48.26,104.78 48.26,106.05 SV37.21 48.26,107.31 48.26,108.58 SV37.22
N$421
  Bottom 0.635: SV38.20 45.72,104.78 45.72,106.05 SV37.19 45.72,107.31 45.72,108.58 SV37.20
N$422
  Bottom 0.635: SV38.18 43.18,104.78 43.18,106.05 SV37.17 43.18,107.31 43.18,108.58 SV37.18
N$423
  Bottom 0.635: SV38.16 40.64,104.78 40.64,106.05 SV37.15 40.64,107.31 40.64,108.58 SV37.16
N$424
  Bottom 0.635: SV38.14 38.1,104.78 38.1,106.05 SV37.13 38.1,107.31 38.1,108.58 SV37.14
N$425
  Bottom 0.635: SV38.12 35.56,104.78 35.56,106.05 SV37.11 35.56,107.31 35.56,108.58 SV37.12
N$426
  Bottom 0.635: SV38.10 33.02,104.78 33.02,106.05 SV37.9 33.02,107.31 33.02,108.58 SV37.10
N$427
  Bottom 0.635: SV38.8 30.48,104.78 30.48,106.05 SV37.7 30.48,107.31 30.48,108.58 SV37.8
N$428
  Bottom 0.635: SV38.6 27.94,104.78 27.94,106.05 SV37.5 27.94,107.31 27.94,108.58 SV37.6
N$429
  Bottom 0.635: SV38.4 25.4,104.78 25.4,106.05 SV37.3 25.4,107.31 25.4,108.58 SV37.4
N$430
  Bottom 0.635: SV38.2 22.86,104.78 22.86,106.05 SV37.1 22.86,107.31 22.86,108.58 SV37.2
N$431
  Bottom 0.635: SV40.36 116.84,104.78 116.84,106.05 SV39.35 116.84,107.31 116.84,108.58 SV39.36
N$432
  Bottom 0.635: SV40.34 114.3,104.78 114.3,106.05 SV39.33 114.3,107.31 114.3,108.58 SV39.34
N$433
  Bottom 0.635: SV40.32 111.76,104.78 111.76,106.05 SV39.31 111.76,107.31 111.76,108.58 SV39.32
N$434
  Bottom 0.635: SV40.30 109.22,104.78 109.22,106.05 SV39.29 109.22,107.31 109.22,108.58 SV39.30
N$435
  Bottom 0.635: SV40.28 106.68,104.78 106.68,106.05 SV39.27 106.68,107.31 106.68,108.58 SV39.28
N$436
  Bottom 0.635: SV40.26 104.14,104.78 104.14,106.05 SV39.25 104.14,107.31 104.14,108.58 SV39.26
N$437
  Bottom 0.635: SV40.24 101.6,104.78 101.6,106.05 SV39.23 101.6,107.31 101.6,108.58 SV39.24
N$438
  Bottom 0.635: SV40.22 99.06,104.78 99.06,106.05 SV39.21 99.06,107.31 99.06,108.58 SV39.22
N$439
  Bottom 0.635: SV40.20 96.52,104.78 96.52,106.05 SV39.19 96.52,107.31 96.52,108.58 SV39.20
N$440
  Bottom 0.635: SV40.18 93.98,104.78 93.98,106.05 SV39.17 93.98,107.31 93.98,108.58 SV39.18
N$441
  Bottom 0.635: SV40.16 91.44,104.78 91.44,106.05 SV39.15 91.44,107.31 91.44,108.58 SV39.16
N$442
  Bottom 0.635: SV40.14 88.9,104.78 88.9,106.05 SV39.13 88.9,107.31 88.9,108.58 SV39.14
N$443
  Bottom 0.635: SV40.12 86.36,104.78 86.36,106.05 SV39.11 86.36,107.31 86.36,108.58 SV39.12
N$444
  Bottom 0.635: SV40.10 83.82,104.78 83.82,106.05 SV39.9 83.82,107.31 83.82,108.58 SV39.10
N$445
  Bottom 0.635: SV40.8 81.28,104.78 81.28,106.05 SV39.7 81.28,107.31 81.28,108.58 SV39.8
N$446
  Bottom 0.635: SV40.6 78.74,104.78 78.74,106.05 SV39.5 78.74,107.31 78.74,108.58 SV39.6
N$447
  Bottom 0.635: SV40.4 76.2,104.78 76.2,106.05 SV39.3 76.2,107.31 76.2,108.58 SV39.4
N$448
  Bottom 0.635: SV40.2 73.66,104.78 73.66,106.05 SV39.1 73.66,107.31 73.66,108.58 SV39.2
N$449
  Bottom 0.635: SV43.1 22.86,92.08 22.86,93.34 SV43.2 22.86,94.61 22.86,95.89 SV44.1
N$450
  Bottom 0.635: SV43.3 25.4,92.08 25.4,93.34 SV43.4 25.4,94.61 25.4,95.89 SV44.3
N$451
  Bottom 0.635: SV43.5 27.94,92.08 27.94,93.34 SV43.6 27.94,94.61 27.94,95.89 SV44.5
N$452
  Bottom 0.635: SV43.7 30.48,92.08 30.48,93.34 SV43.8 30.48,94.61 30.48,95.89 SV44.7
N$453
  Bottom 0.635: SV43.9 33.02,92.08 33.02,93.34 SV43.10 33.02,94.61 33.02,95.89 SV44.9
N$454
  Bottom 0.635: SV43.11 35.56,92.08 35.56,93.34 SV43.12 35.56,94.61 35.56,95.89 SV44.11
N$455
  Bottom 0.635: SV43.13 38.1,92.08 38.1,93.34 SV43.14 38.1,94.61 38.1,95.89 SV44.13
N$456
  Bottom 0.635: SV43.15 40.64,92.08 40.64,93.34 SV43.16 40.64,94.61 40.64,95.89 SV44.15
N$457
  Bottom 0.635: SV43.17 43.18,92.08 43.18,93.34 SV43.18 43.18,94.61 43.18,95.89 SV44.17
N$458
  Bottom 0.635: SV43.19 45.72,92.08 45.72,93.34 SV43.20 45.72,94.61 45.72,95.89 SV44.19
N$459
  Bottom 0.635: SV43.21 48.26,92.08 48.26,93.34 SV43.22 48.26,94.61 48.26,95.89 SV44.21
N$460
  Bottom 0.635: SV43.23 50.8,92.08 50.8,93.34 SV43.24 50.8,94.61 50.8,95.89 SV44.23
N$461
  Bottom 0.635: SV43.25 53.34,92.08 53.34,93.34 SV43.26 53.34,94.61 53.34,95.89 SV44.25
N$462
  Bottom 0.635: SV43.27 55.88,92.08 55.88,93.34 SV43.28 55.88,94.61 55.88,95.89 SV44.27
N$463
  Bottom 0.635: SV43.29 58.42,92.08 58.42,93.34 SV43.30 58.42,94.61 58.42,95.89 SV44.29
N$464
  Bottom 0.635: SV43.31 60.96,92.08 60.96,93.34 SV43.32 60.96,94.61 60.96,95.89 SV44.31
N$465
  Bottom 0.635: SV43.33 63.5,92.08 63.5,93.34 SV43.34 63.5,94.61 63.5,95.89 SV44.33
N$466
  Bottom 0.635: SV43.35 66.04,92.08 66.04,93.34 SV43.36 66.04,94.61 66.04,95.89 SV44.35
N$467
  Bottom 0.635: SV43.37 68.58,92.08 68.58,93.34 SV43.38 68.58,94.61 68.58,95.89 SV44.37
N$468
  Bottom 0.635: SV43.39 71.12,92.08 71.12,93.34 SV43.40 71.12,94.61 71.12,95.89 SV44.39
N$469
  Bottom 0.635: SV41.1 73.66,71.75 73.66,73.03 SV41.2 73.66,74.3 73.66,75.56 SV42.1
N$470
  Bottom 0.635: SV41.3 76.2,71.75 76.2,73.03 SV41.4 76.2,74.3 76.2,75.56 SV42.3
N$471
  Bottom 0.635: SV41.5 78.74,71.75 78.74,73.03 SV41.6 78.74,74.3 78.74,75.56 SV42.5
N$472
  Bottom 0.635: SV41.7 81.28,71.75 81.28,73.03 SV41.8 81.28,74.3 81.28,75.56 SV42.7
N$473